# Altium schematic sheet KeeWatch_LCD.SchDoc
size Letter
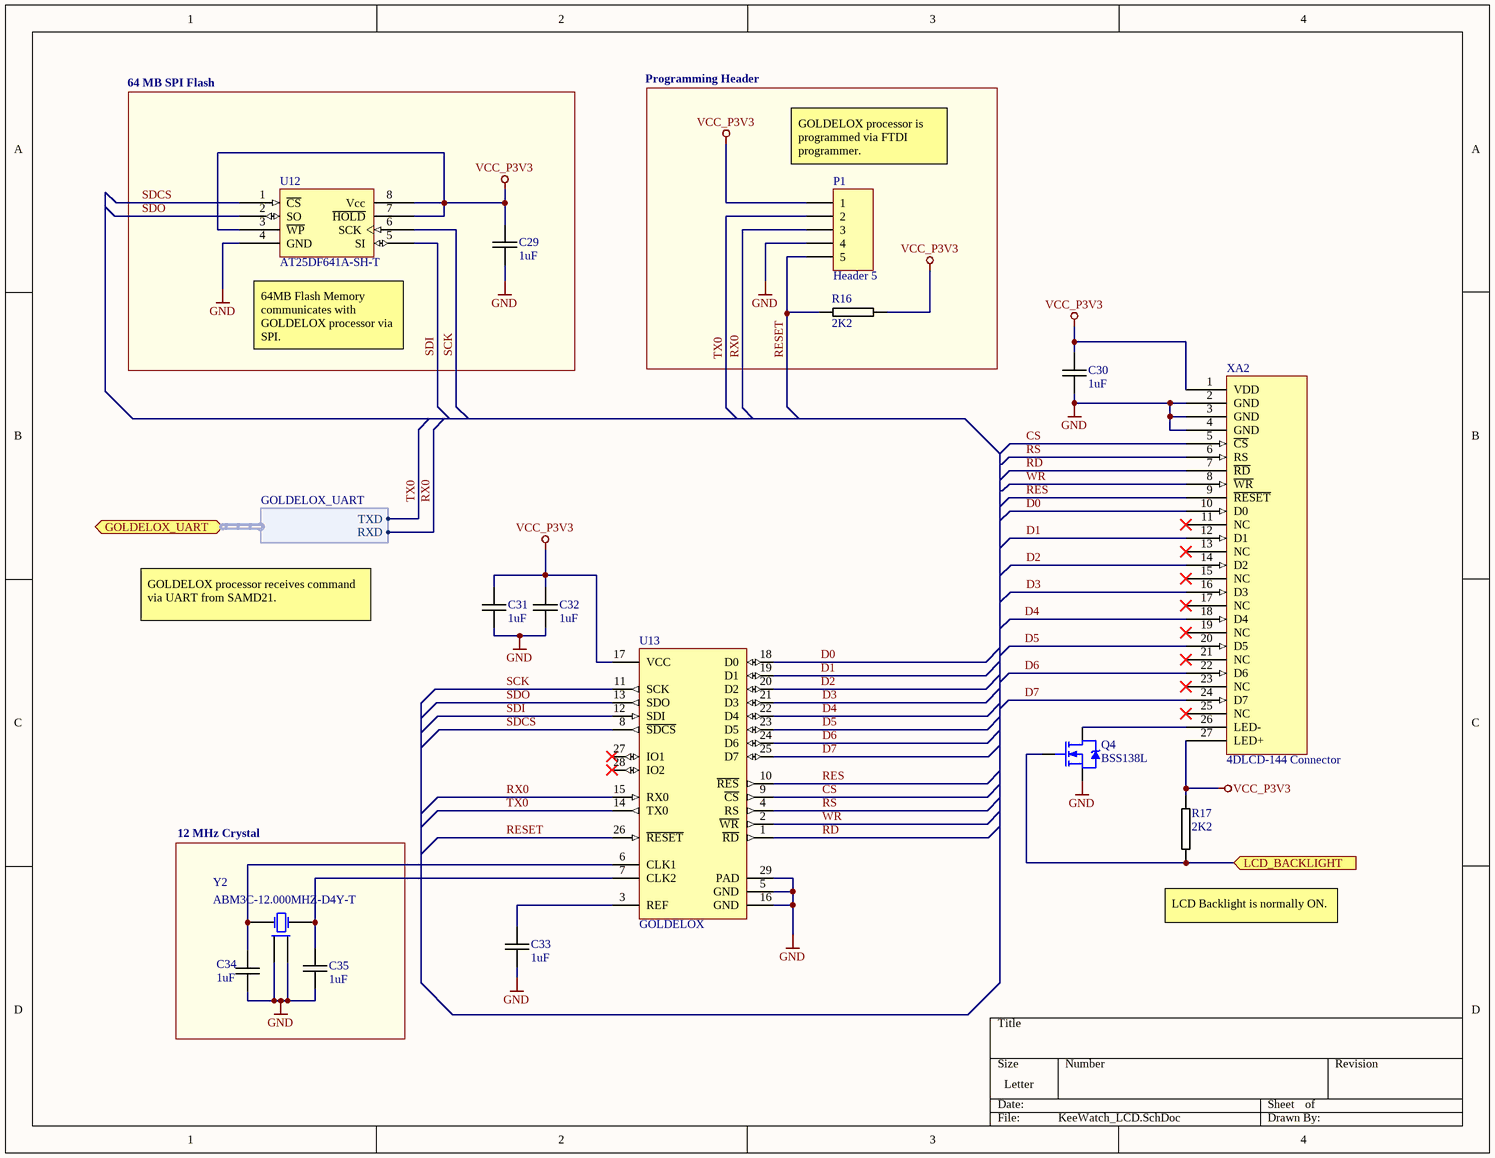
[diagram p0: KeeWatch_LCD.SchDoc]

## Parts
C29  1uF  [0603-Cap]
C30  1uF  [0603-Cap]
C31  1uF  [0603-Cap]
C32  1uF  [0603-Cap]
C33  1uF  [0603-Cap]
C34  1uF  [0603-Cap]
C35  1uF  [0603-Cap]
P1  Header 5  [1x5 header]
Q4  BSS138L  [SOT23-GDS]
R16  2K2  [0603-RES]
R17  2K2  [0603-RES]
U12  AT25DF641A-SH-T  [SO8_N]
U13  GOLDELOX  [4DS-QFN-3700X3700-28_V]
XA2  4DLCD-144 Connector  [4DLCD-144 27-pin Connector]
Y2  ABM3C-12.000MHZ-D4Y-T  [CRYSTAL]

## Blocks framed on the sheet
64 MB SPI Flash: C29 U12
Programming Header: P1 R16
12 MHz Crystal: C34 C35 Y2

## Ports
GOLDELOX_UART (harness GOLDELOX_UART), LCD_BACKLIGHT (in)

## Harnesses
GOLDELOX_UART: TXD, RXD

## Nets
GND: C29.2 C30.2 C31.2 C32.2 C33.2 C34.2 C35.2 P1.4 Q4.3(S) U12.4(GND) U13.5(GND) U13.16(GND) U13.29(PAD) XA2.2(GND) XA2.3(GND) XA2.4(GND) Y2.3(GND) Y2.4(GND)
VCC_P3V3: C29.1 C30.1 C31.1 C32.1 P1.1 R16.2 R17.1 U12.3(~{WP}) U12.7(~{HOLD}) U12.8(Vcc) U13.17(VCC) XA2.1(VDD) XA2.27(LED+)
CS: U13.9(~{CS}) XA2.5(~{CS})
D0: U13.18(D0) XA2.10(D0)
D1: U13.19(D1) XA2.12(D1)
D2: U13.20(D2) XA2.14(D2)
D3: U13.21(D3) XA2.16(D3)
D4: U13.22(D4) XA2.18(D4)
D5: U13.23(D5) XA2.20(D5)
D6: U13.24(D6) XA2.22(D6)
D7: U13.25(D7) XA2.24(D7)
LCD_BACKLIGHT: Q4.1(G) R17.2 ; port LCD_BACKLIGHT
RD: U13.1(~{RD}) XA2.7(~{RD})
RES: U13.10(~{RES}) XA2.9(~{RESET})
RESET: P1.5 R16.1 U13.26(~{RESET})
RS: U13.4(RS) XA2.6(RS)
RX0: P1.3 U13.15(RX0) ; port GOLDELOX_UART.RXD
SCK: U12.6(SCK) U13.11(SCK)
SDCS: U12.1(~{CS}) U13.8(~{SDCS})
SDI: U12.5(SI) U13.12(SDI)
SDO: U12.2(SO) U13.13(SDO)
TX0: P1.2 U13.14(TX0) ; port GOLDELOX_UART.TXD
WR: U13.2(~{WR}) XA2.8(~{WR})
NetC33_1: C33.1 U13.3(REF)
NetC34_1: C34.1 U13.6(CLK1) Y2.1(OSC1)
NetC35_1: C35.1 U13.7(CLK2) Y2.2(OSC2)
NetQ4_2: Q4.2(D) XA2.26(LED-)

Not connected (* = marked no-connect by the designer): U13 27(IO1)* 28(IO2)*; XA2 11(NC)* 13(NC)* 15(NC)* 17(NC)* 19(NC)* 21(NC)* 23(NC)* 25(NC)*

## Notes on the sheet
- (near P1) GOLDELOX processor is programmed via FTDI programmer.
- (near U12) 64MB Flash Memory communicates with GOLDELOX processor via SPI.
- GOLDELOX processor receives command via UART from SAMD21.
- (near R17) LCD Backlight is normally ON.

## Library data of the parts
C29-C35 = 0603-Cap: CAPACITOR 0603 CERAMIC
P1 = Header 5: Header, 5-Pin; LatestRevisionDate: 17-Jul-2002; LatestRevisionNote: Re-released for DXP Platform.; Publisher: Altium Limited
R16 R17 = 0603-Res: GENERIC RESISTOR 0603
U12 = AT25DF641A-SH-T: 64-Mbit, 2.7V Minimum SPI Serial Flash Memory with Dual–I/O Support
U13 = GOLDELOX: GOLDELOX Processor, Embedded Graphics Controller, 10 KB FLASH Memory, 510 B SRAM, 8 bits A/D Converter Resolution,  48 MHz, -40 to 80 degC, 28-Pin QFN, Tube; Manufacturer: 4D Systems; Supply Voltage (VCC): 3 to 3.6 V; External Crystal (Xtal) (Typ.): 12 MHz; Supply Current (ICC) (Typ.): 12 mA; Internal Operating Frequency: 48 MHz; A/D Converter Resolution (Typ.): 8 Bits; FLASH memory: 10 KB; SRAM: 510 B; Flash Memory Endurance: 1000 E/W; DatasheetVersion: Rev. 1.0; PackageVersion: Rev. 1.0; PackageReference: QFN-28; PackageDescription: 28-Pin Quad Flat No-lead Package, Body 6 x 6 mm, Pitch 0.65 mm; Supplier 1: Mouser; Supplier Part Number 1: 971-GOLDELOX; Operating Temperature Range: -40 to 80 degC; Packing: Tube; Mounting Technology: Surface Mount; PartNumber: GOLDELOX; ComponentLink1Description: Manufacturer URL; ComponentLink1URL: http://www.4dsystems.com.au/; ComponentLink2Description: Datasheet; ComponentLink2URL: http://www.4dsystems.com.au/productpages/GOLDELOX/downloads/GOLDELOX_datasheet_R_1_0.pdf
XA2 = 4DLCD-144 Connector: 4DLCD-144 27-pin Flex Connector
Y2 = ABM3C-12.000MHZ-D4Y-T: CERAMIC SMD CRYSTAL